# Altium schematic sheet PLL_Controller_STM32.SchDoc: MAX_2870
size A4; Organization: Salil Tembe; Address1: Nuclearrambo.com; Address2: admin@nuclearrambo.com; DocumentNumber: 2; Revision: 2; SheetNumber: 2; SheetTotal: 3
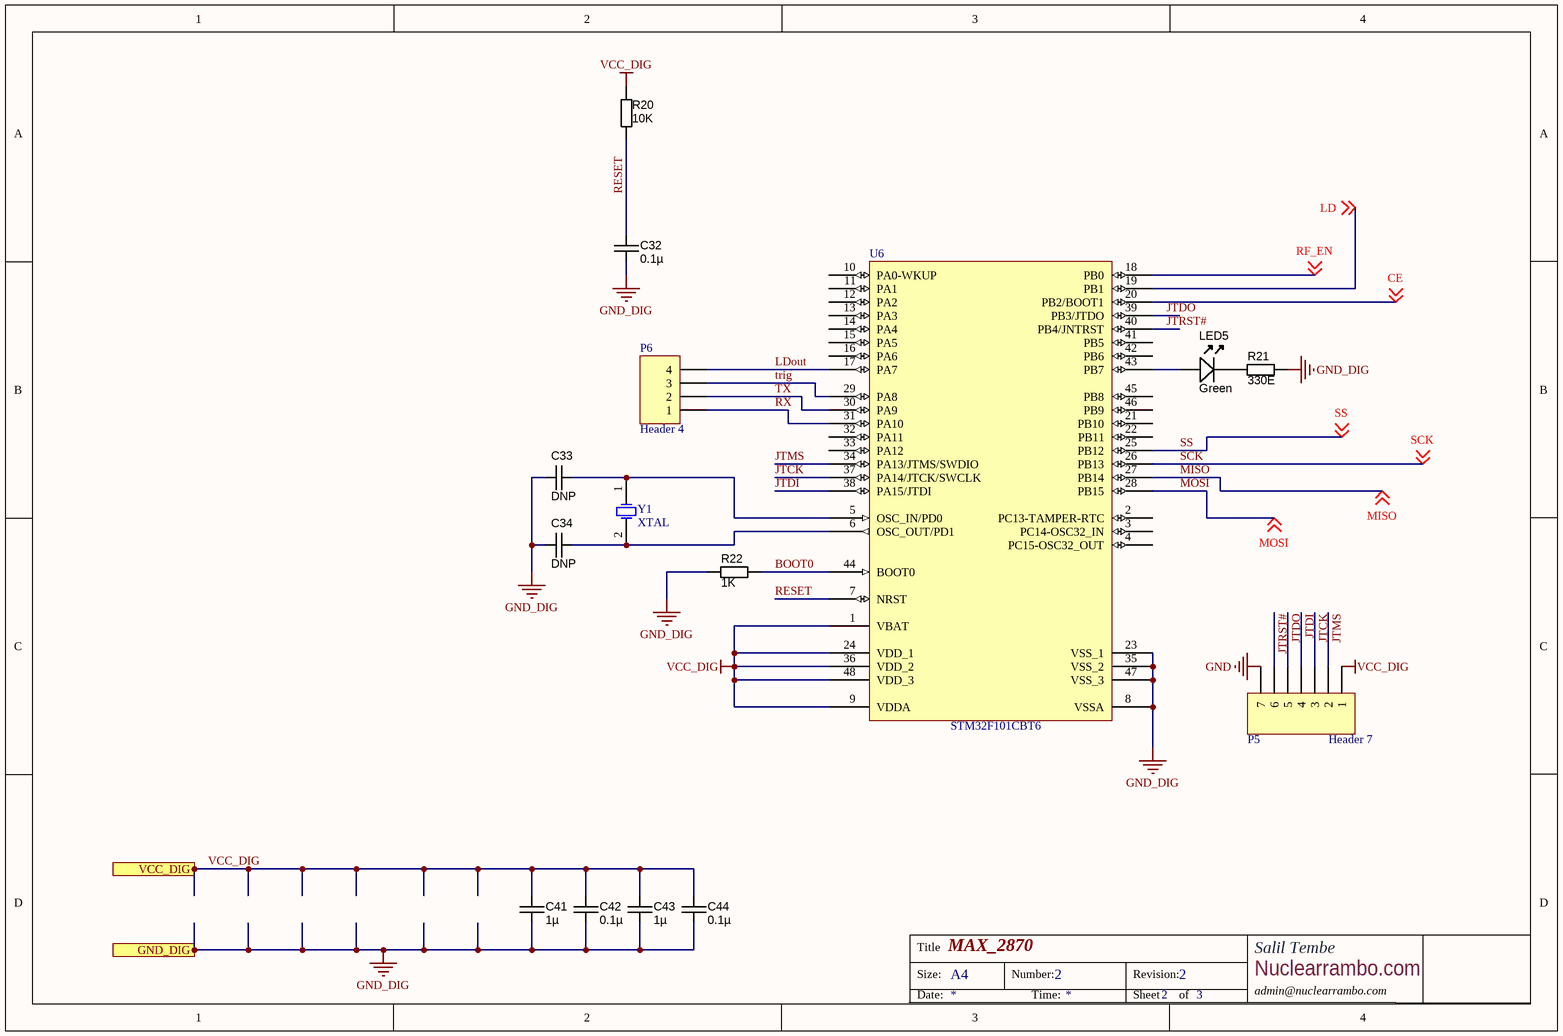
[diagram p0: PLL_Controller_STM32.SchDoc]

## Parts
C32  value 0.1µ  [CAPC2012X135N]  (hidden comment: approved sub OK)
C33  value DNP  [CAPC2012X135N]  (hidden comment: approved sub OK)
C34  value DNP  [CAPC2012X135N]  (hidden comment: approved sub OK)
C41  value 1µ  [CAPC2012X135N]  (hidden comment: approved sub OK)
C42  value 0.1µ  [CAPC2012X135N]  (hidden comment: approved sub OK)
C43  value 1µ  [CAPC2012X135N]  (hidden comment: approved sub OK)
C44  value 0.1µ  [CAPC2012X135N]  (hidden comment: approved sub OK)
LED5  Green  [LED-0603-GREEN]
P5  Header 7  [HDR1X7]
P6  Header 4  [HDR1X4]
R20  value 10K  [RESC1005X40N]  (hidden comment: Thick Film)
R21  value 330E  [RESC1005X40N]  (hidden comment: Thick Film)
R22  value 1K  [RESC1005X40N]  (hidden comment: Thick Film)
U6  STM32F101CBT6  [LQFP48_N]
Y1  XTAL  [R38]

## Ports
GND_DIG (in), VCC_DIG (in)

## Nets
GND: P5.7
GND_DIG: C32.1 C33.1 C34.1 C41.1 C42.1 C43.1 C44.1 R21.2 R22.1 U6.8(VSSA) U6.23(VSS_1) U6.35(VSS_2) U6.47(VSS_3) ; port GND_DIG
VCC_DIG: C41.2 C42.2 C43.2 C44.2 P5.1 R20.2 U6.1(VBAT) U6.9(VDDA) U6.24(VDD_1) U6.36(VDD_2) U6.48(VDD_3) ; port VCC_DIG
BOOT0: R22.2 U6.44(BOOT0)
CE: U6.20(PB2/BOOT1) ; off-sheet CE
JTCK: P5.3 U6.37(PA14/JTCK/SWCLK)
JTDI: P5.4 U6.38(PA15/JTDI)
JTDO: P5.5 U6.39(PB3/JTDO)
JTMS: P5.2 U6.34(PA13/JTMS/SWDIO)
JTRST#: P5.6 U6.40(PB4/JNTRST)
LD: U6.19(PB1) ; off-sheet LD
LDout: P6.4 U6.17(PA7)
MISO: U6.27(PB14) ; off-sheet MISO
MOSI: U6.28(PB15) ; off-sheet MOSI
RESET: C32.2 R20.1 U6.7(NRST)
RF_EN: U6.18(PB0) ; off-sheet RF_EN
RX: P6.1 U6.31(PA10)
SCK: U6.26(PB13) ; off-sheet SCK
SS: U6.25(PB12) ; off-sheet SS
trig: P6.3 U6.29(PA8)
TX: P6.2 U6.30(PA9)
NetC33_2: C33.2 U6.5(OSC_IN/PD0) Y1.1(OSC1)
NetC34_2: C34.2 U6.6(OSC_OUT/PD1) Y1.2(OSC2)
NetLED5_A: LED5.A U6.43(PB7)
NetLED5_K: LED5.K R21.1

Not connected (* = marked no-connect by the designer): U6 2(PC13-TAMPER-RTC) 3(PC14-OSC32_IN) 4(PC15-OSC32_OUT) 10(PA0-WKUP) 11(PA1) 12(PA2) 13(PA3) 14(PA4) 15(PA5) 16(PA6) 21(PB10) 22(PB11) 32(PA11) 33(PA12) 41(PB5) 42(PB6) 45(PB8) 46(PB9)

## Notes on the sheet
- Title
- Size:
- A4
- Number:
- Revision:
- Date:
- Time:
- Sheet
- of

## Library data of the parts
C32-C34 C41-C44 = CAPC_10u_0805_10V: Capacitor SMD Cer 10uF 10% 10V X5R 0805; Manufacturer 1: AVX Corporation; Manufacturer Part Number 1: 0805ZD106KAT2A; Ratings: 10V; X5R; Material: ceramic; SCDType: spec; Package / Case: 0805 (2012 metric); Tolerance: ±10%; Manufacturer 2: Kemet; Manufacturer Part Number 2: C0805C106K8PACTU; Supplier 1: Digi-Key; Supplier Part Number 1: 478-5167-1-ND; ComponentLink1URL: http://www.avx.com/docs/Catalogs/cx5r.pdf; ComponentLink1Description: http://www.avx.com/docs/Catalogs/cx5r.pdf; ComponentLink2URL: http://www.kemet.com/datasheets&C0805C106K8PACTU; ComponentLink2Description: http://www.kemet.com/datasheets&C0805C106K8PACTU; Supplier 2: Digi-Key; Supplier Part Number 2: 399-4925-1-ND
LED5 = LED_SMD_Green_0603_570nm: LED 0603 SMD Green 570nm 50mcd 20mA; Manufacturer 1: Kingbright Company LLC; Manufacturer Part Number 1: APT1608CGCK; Material: AlGaInP; Ratings: 20mcd min; 50 mcd typ; 570 nm; Voltage - Forward (Vf) Typ: 2.1V; Viewing Angle: 120°; Lens Style/Size: Rectangle with Flat Top, 1.1mm x 0.8mm; Voltage - Forward (Vf) @ 10mA: 2.0V; SCDType: source; Wavelength - Peak: 574nm; Lens Type: Clear; Package / Case: 0603 (1608 metric); Color: Green; Current - Test: 20mA; Supplier 1: Digi-Key; Supplier Part Number 1: 754-1116-1-ND; RoHS 1: RoHS Compliant; Wavelength - Dominant: 570nm; ComponentLink1URL: http://www.us.kingbright.com/images/catalog/SPEC/APT1608CGCK.pdf; ComponentLink1Description: http://www.us.kingbright.com/images/catalog/SPEC/APT1608CGCK.pdf
P5 = Header 7: Header, 7-Pin; LatestRevisionDate: 17-Jul-2002; LatestRevisionNote: Re-released for DXP Platform.; Publisher: Altium Limited
P6 = Header 4: Header, 4-Pin; LatestRevisionDate: 17-Jul-2002; LatestRevisionNote: Re-released for DXP Platform.; Publisher: Altium Limited
R20-R22 = RES_1K_0402_5%: Resistor SMD chip 1k Ohm 0.063W 5% 0402; Manufacturer 1: Yageo; Manufacturer Part Number 1: RC0402JR-071KL; Ratings: 1/16 W; SCDType: spec; Package / Case: 0402 (1005 Metric); Tolerance: ±5%; Supplier 1: Digi-Key; Supplier Part Number 1: 311-1.0KJRCT-ND; RoHS 1: RoHS Compliant; ComponentLink1URL: http://www.yageo.com/documents/recent/PYu-RC0402_51_RoHS_L_6.pdf; ComponentLink1Description: http://www.yageo.com/documents/recent/PYu-RC0402_51_RoHS_L_6.pdf; Supplier 2: Digi-Key; Supplier Part Number 2: 541-1.0KJCT-ND; Manufacturer 2: Vishay Dale; Manufacturer Part Number 2: CRCW04021K00JNED; RoHS 2: RoHS Compliant; ComponentLink2URL: http://www.vishay.com/doc?20035; ComponentLink2Description: http://www.vishay.com/doc?20035; Supplier 3: Digi-Key; Supplier Part Number 3: 1276-4376-1-ND; Manufacturer 3: Samsung Electro-Mechanics America, Inc; Manufacturer Part Number 3: RC1005J102CS; RoHS 3: RoHS Compliant; ComponentLink3URL: http://www.samsungsem.com/servlet/FileDownload?filename=productcatalog/pdf/Chip_Resistor.pdf; ComponentLink3Description: http://www.samsungsem.com/servlet/FileDownload?filename=productcatalog/pdf/Chip_Resistor.pdf; Supplier 4: Digi-Key; Supplier Part Number 4: RHM1.0KCECT-ND; Manufacturer 4: Rohm Semiconductor; Manufacturer Part Number 4: MCR01MRTJ102; RoHS 4: RoHS Compliant; ComponentLink4URL: http://rohmfs.rohm.com/en/products/databook/datasheet/passive/resistor/chip_resistor/mcr_g.pdf; ComponentLink4Description: http://rohmfs.rohm.com/en/products/databook/datasheet/passive/resistor/chip_resistor/mcr_g.pdf; Supplier 5: Digi-Key; Supplier Part Number 5: P1.0KJCT-ND; Manufacturer 5: Panasonic Electronic Components; Manufacturer Part Number 5: ERJ-2GEJ102X; RoHS 5: RoHS Compliant; ComponentLink5URL: http://industrial.panasonic.com/www-cgi/jvcr13pz.cgi?E+PZ+3+AOA0001+ERJ2GEJ102X+7+WW; ComponentLink5Description: http://industrial.panasonic.com/www-cgi/jvcr13pz.cgi?E+PZ+3+AOA0001+ERJ2GEJ102X+7+WW
U6 = STM32F101CBT6: STM32 ARM-based 32-bit MCU with 128 Kbytes Flash, 48-pin LQFP, Industrial Temperature; Published: 30-May-2008; DatasheetVersion: rev6, Mar-2008; PackageVersion: Mar-2008; PackageReference: LQFP48; Publisher: Altium Limited; PackageDescription: 48-Pin Low-Profile Quad Flat Pack, 7 x 7 mm Body, 0.5 mm Pitch (LQFP48); ComponentLink1Description: Manufacturer Link; ComponentLink1URL: www.st.com/stm32; ComponentLink2Description: Datasheet; ComponentLink2URL: http://www.st.com/stonline/products/literature/ds/13586.pdf
Y1 = XTAL: Crystal Oscillator; Published: 8-Jun-2000; LatestRevisionDate: 17-Jul-2002; LatestRevisionNote: Re-released for DXP Platform.; PackageReference: R38; Publisher: Altium Limited; PackageDescription: Crystal, Thru-Hole; 2 Leads; Body 3.1 x 8.2 mm (Dia.xH)